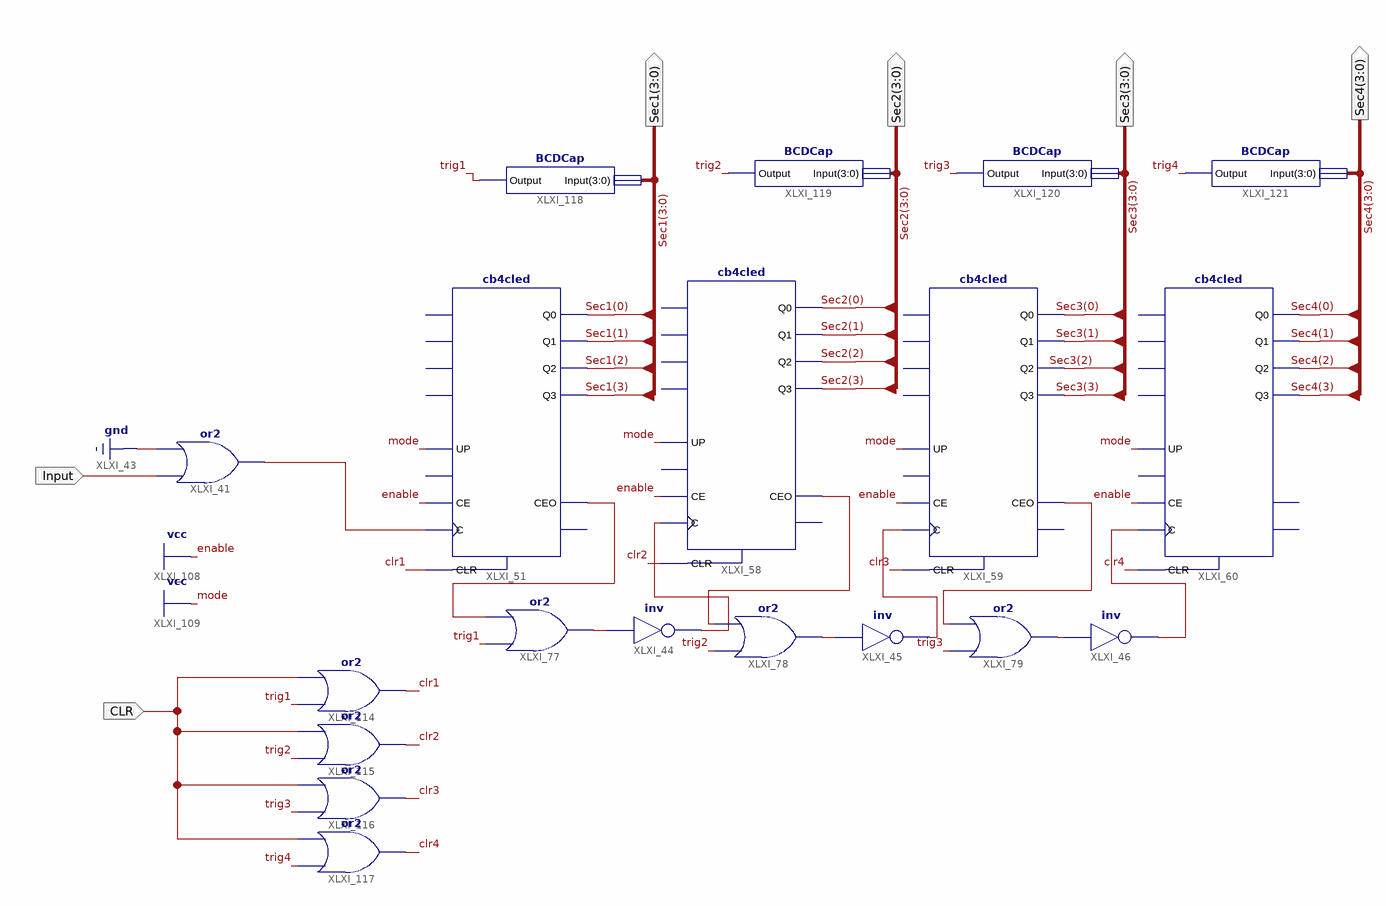
[diagram p0: schematic sheet 1]
// Xilinx ISE schematic UpCounter.sch (spartan6) as structural Verilog: 19 symbols, 6 ports
module UpCounter (
  input  Input,
  input  CLR,
  output [3:0] Sec1,
  output [3:0] Sec2,
  output [3:0] Sec3,
  output [3:0] Sec4
);

  wire clr1, clr2, clr3, clr4, trig1, trig2, trig3, trig4, XLXN_107, XLXN_108, XLXN_109, XLXN_113, XLXN_114,
       XLXN_115, XLXN_130, XLXN_157, XLXN_158, XLXN_163;

  or XLXI_41 (XLXN_130, Input, 1'b0);
  cb4cled XLXI_51 (
    .C(XLXN_130), .CE(1'b1), .CLR(clr1), .UP(1'b1), .CEO(XLXN_113), .Q0(Sec1[0]), .Q1(Sec1[1]), .Q2(Sec1[2]),
    .Q3(Sec1[3]));  // open: D0, D1, D2, D3, L, TC
  cb4cled XLXI_58 (
    .C(XLXN_157), .CE(1'b1), .CLR(clr2), .UP(1'b1), .CEO(XLXN_114), .Q0(Sec2[0]), .Q1(Sec2[1]), .Q2(Sec2[2]),
    .Q3(Sec2[3]));  // open: D0, D1, D2, D3, L, TC
  cb4cled XLXI_59 (
    .C(XLXN_158), .CE(1'b1), .CLR(clr3), .UP(1'b1), .CEO(XLXN_115), .Q0(Sec3[0]), .Q1(Sec3[1]), .Q2(Sec3[2]),
    .Q3(Sec3[3]));  // open: D0, D1, D2, D3, L, TC
  cb4cled XLXI_60 (
    .C(XLXN_163), .CE(1'b1), .CLR(clr4), .UP(1'b1), .Q0(Sec4[0]), .Q1(Sec4[1]), .Q2(Sec4[2]), .Q3(Sec4[3]));  // open: D0, D1, D2, D3, L, CEO, TC
  or XLXI_77 (XLXN_107, trig1, XLXN_113);
  or XLXI_78 (XLXN_108, trig2, XLXN_114);
  or XLXI_79 (XLXN_109, trig3, XLXN_115);
  not XLXI_44 (XLXN_157, XLXN_107);
  not XLXI_45 (XLXN_158, XLXN_108);
  not XLXI_46 (XLXN_163, XLXN_109);
  or XLXI_114 (clr1, trig1, CLR);
  or XLXI_115 (clr2, trig2, CLR);
  or XLXI_116 (clr3, trig3, CLR);
  or XLXI_117 (clr4, trig4, CLR);
  BCDCap XLXI_118 (.Input(Sec1), .Output(trig1));
  BCDCap XLXI_119 (.Input(Sec2), .Output(trig2));
  BCDCap XLXI_120 (.Input(Sec3), .Output(trig3));
  BCDCap XLXI_121 (.Input(Sec4), .Output(trig4));
endmodule
